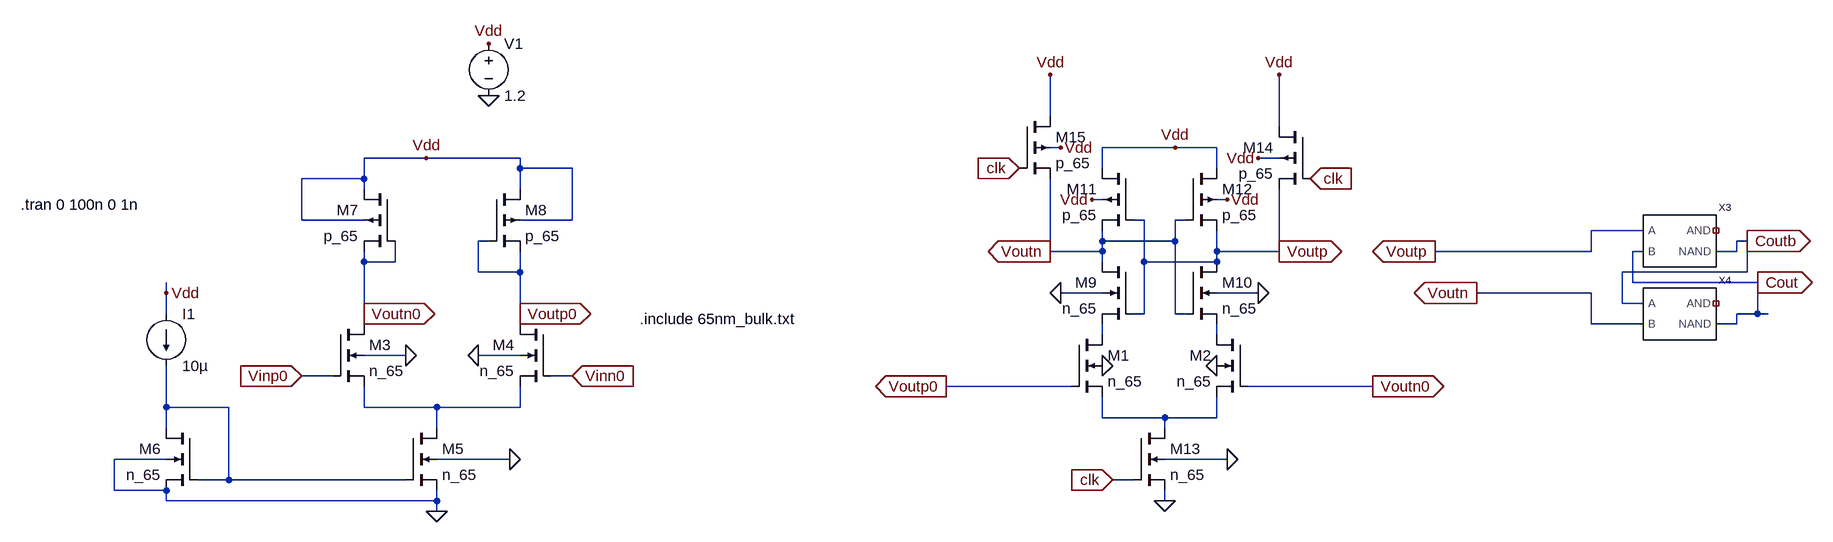
[diagram p0: schematic Comp2.asc]
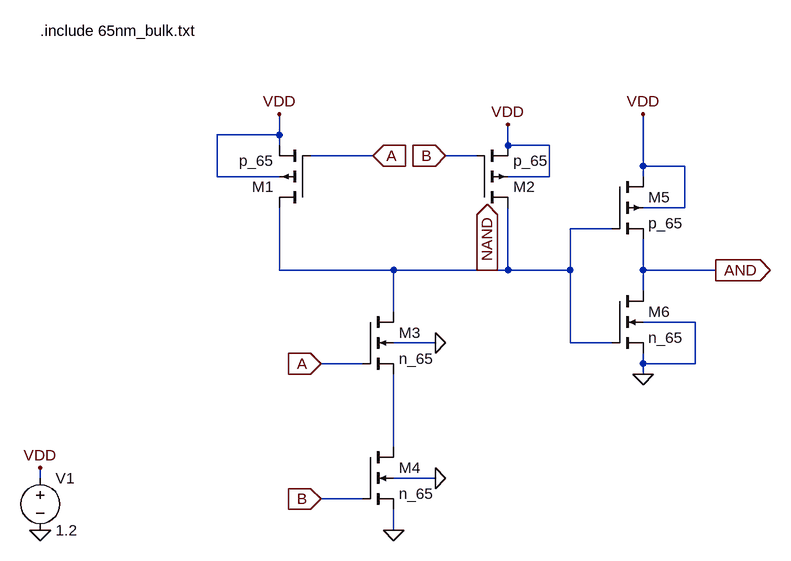
[diagram p1: sub-circuit nand.asc]
Comp2.asc, the LTspice schematic file:
Version 4
SHEET 1 2404 740
WIRE 1136 -96 1136 -160
WIRE 1488 -80 1488 -160
WIRE 1152 -48 1136 -48
WIRE 1328 -48 1216 -48
WIRE 1392 -48 1328 -48
WIRE 176 -32 80 -32
WIRE 320 -32 176 -32
WIRE 1488 -32 1456 -32
WIRE 320 -16 320 -32
WIRE 400 -16 320 -16
WIRE 1216 -16 1216 -48
WIRE 1392 -16 1392 -48
WIRE 80 0 80 -32
WIRE 80 0 -16 0
WIRE 80 16 80 0
WIRE 320 16 320 -16
WIRE 1216 32 1200 32
WIRE 1408 32 1392 32
WIRE -16 64 -16 0
WIRE 80 64 -16 64
WIRE 400 64 400 -16
WIRE 400 64 320 64
WIRE 1280 64 1264 64
WIRE 1344 64 1328 64
WIRE 2048 80 1968 80
WIRE 272 96 256 96
WIRE 1216 96 1216 80
WIRE 1328 96 1328 64
WIRE 1328 96 1216 96
WIRE 2208 96 2192 96
WIRE 1136 112 1136 0
WIRE 1216 112 1216 96
WIRE 1216 112 1136 112
WIRE 1392 112 1392 80
WIRE 1488 112 1488 16
WIRE 1488 112 1392 112
WIRE 1968 112 1968 80
WIRE 1968 112 1728 112
WIRE 2048 112 2032 112
WIRE 2192 112 2192 96
WIRE 2192 112 2160 112
WIRE 80 128 80 112
WIRE 128 128 128 96
WIRE 128 128 80 128
WIRE 1216 128 1216 112
WIRE 1280 128 1280 64
WIRE 1392 128 1392 112
WIRE 1392 128 1280 128
WIRE 256 144 256 96
WIRE 320 144 320 112
WIRE 320 144 256 144
WIRE 2208 144 2208 96
WIRE 2208 144 2016 144
WIRE 2032 160 2032 112
WIRE 2224 160 2032 160
WIRE -224 176 -224 160
WIRE 1216 176 1152 176
WIRE 1456 176 1392 176
WIRE 1968 176 1792 176
WIRE 2016 192 2016 144
WIRE 2048 192 2016 192
WIRE -224 208 -224 176
WIRE 80 208 80 128
WIRE 320 208 320 144
WIRE 1280 208 1280 128
WIRE 1280 208 1264 208
WIRE 1328 208 1328 96
WIRE 1344 208 1328 208
WIRE 2224 208 2224 160
WIRE 2224 208 2192 208
WIRE 2240 208 2224 208
WIRE 80 224 80 208
WIRE 320 224 320 208
WIRE 1968 224 1968 176
WIRE 2048 224 1968 224
WIRE 2192 224 2192 208
WIRE 2192 224 2160 224
WIRE 1216 240 1216 224
WIRE 1392 240 1392 224
WIRE 144 272 80 272
WIRE 320 272 256 272
WIRE 32 304 -16 304
WIRE 400 304 368 304
WIRE 1168 320 976 320
WIRE 1632 320 1440 320
WIRE -224 352 -224 288
WIRE -128 352 -224 352
WIRE 80 352 80 320
WIRE 192 352 80 352
WIRE 320 352 320 320
WIRE 320 352 192 352
WIRE 1216 368 1216 336
WIRE 1312 368 1216 368
WIRE 1392 368 1392 336
WIRE 1392 368 1312 368
WIRE -224 384 -224 352
WIRE 192 384 192 352
WIRE 1312 384 1312 368
WIRE -224 432 -304 432
WIRE 304 432 192 432
WIRE 1408 432 1312 432
WIRE -128 464 -128 352
WIRE -128 464 -176 464
WIRE 144 464 -128 464
WIRE 1264 464 1232 464
WIRE -304 480 -304 432
WIRE -224 480 -304 480
WIRE -224 496 -224 480
WIRE 192 496 192 480
WIRE 192 496 -224 496
WIRE 1312 496 1312 480
WIRE 192 512 192 496
FLAG 192 512 0
FLAG 272 -208 Vdd
FLAG 272 -128 0
FLAG 256 272 0
FLAG 144 272 0
FLAG -16 304 Vinp0
IOPIN -16 304 In
FLAG 400 304 Vinn0
IOPIN 400 304 In
FLAG 320 208 Voutp0
IOPIN 320 208 Out
FLAG 80 208 Voutn0
IOPIN 80 208 Out
FLAG 304 432 0
FLAG -224 176 Vdd
FLAG 176 -32 Vdd
FLAG 1136 -160 Vdd
FLAG 1488 -160 Vdd
FLAG 1312 496 0
FLAG 1232 464 clk
IOPIN 1232 464 In
FLAG 1328 -48 Vdd
FLAG 1152 176 0
FLAG 1456 176 0
FLAG 1408 432 0
FLAG 1408 32 Vdd
FLAG 1200 32 Vdd
FLAG 1456 -32 Vdd
FLAG 1152 -48 Vdd
FLAG 1088 -16 clk
IOPIN 1088 -16 In
FLAG 1536 0 clk
IOPIN 1536 0 In
FLAG 1136 112 Voutn
IOPIN 1136 112 Out
FLAG 1488 112 Voutp
IOPIN 1488 112 Out
FLAG 1216 288 0
FLAG 1392 288 0
FLAG 976 320 Voutp0
IOPIN 976 320 Out
FLAG 1632 320 Voutn0
IOPIN 1632 320 Out
FLAG 2224 160 Cout
IOPIN 2224 160 Out
FLAG 2208 96 Coutb
IOPIN 2208 96 Out
FLAG 1728 112 Voutp
IOPIN 1728 112 Out
FLAG 1792 176 Voutn
IOPIN 1792 176 Out
DATAFLAG 80 192 ""
DATAFLAG 80 464 ""
DATAFLAG 192 368 ""
SYMBOL nmos4 32 224 R0
SYMATTR InstName M3
SYMATTR Value n_65
SYMATTR Value2 l=1u w=80u
SYMBOL nmos4 368 224 M0
SYMATTR InstName M4
SYMATTR Value n_65
SYMATTR Value2 l=1u w=80u
SYMBOL nmos4 144 384 R0
SYMATTR InstName M5
SYMATTR Value n_65
SYMATTR Value2 l=1u w=160u
SYMBOL voltage 272 -224 R0
WINDOW 123 0 0 Left 0
WINDOW 39 0 0 Left 0
SYMATTR InstName V1
SYMATTR Value 1.2
SYMBOL nmos4 -176 384 M0
SYMATTR InstName M6
SYMATTR Value n_65
SYMATTR Value2 l=1u w=80u
SYMBOL current -224 208 R0
WINDOW 123 0 0 Left 0
WINDOW 39 0 0 Left 0
SYMATTR InstName I1
SYMATTR Value 10µ
SYMBOL pmos4 128 16 M0
SYMATTR InstName M7
SYMATTR Value p_65
SYMATTR Value2 l=1u w=2u
SYMBOL pmos4 272 16 R0
SYMATTR InstName M8
SYMATTR Value p_65
SYMATTR Value2 l=1u w=2u
SYMBOL nmos4 1168 240 R0
SYMATTR InstName M1
SYMATTR Value n_65
SYMATTR Value2 l=0.1u w=10u
SYMBOL nmos4 1440 240 M0
SYMATTR InstName M2
SYMATTR Value n_65
SYMATTR Value2 l=0.1u w=10u
SYMBOL nmos4 1264 128 M0
SYMATTR InstName M9
SYMATTR Value n_65
SYMATTR Value2 l=65n w=0.8u
SYMBOL nmos4 1344 128 R0
SYMATTR InstName M10
SYMATTR Value n_65
SYMATTR Value2 l=65n w=0.8u
SYMBOL pmos4 1264 -16 M0
SYMATTR InstName M11
SYMATTR Value p_65
SYMATTR Value2 l=65n w=1.6u
SYMBOL pmos4 1344 -16 R0
SYMATTR InstName M12
SYMATTR Value p_65
SYMATTR Value2 l=65n w=1.6u
SYMBOL nmos4 1264 384 R0
SYMATTR InstName M13
SYMATTR Value n_65
SYMATTR Value2 l=0.1u w=20u
SYMBOL pmos4 1536 -80 M0
SYMATTR InstName M14
SYMATTR Value p_65
SYMATTR Value2 l=65n w=1u
SYMBOL pmos4 1088 -96 R0
SYMATTR InstName M15
SYMATTR Value p_65
SYMATTR Value2 l=65n w=1u
SYMBOL nand 2096 96 R0
SYMATTR InstName X3
SYMBOL nand 2096 208 R0
SYMATTR InstName X4
TEXT 504 216 Left 2 !.include 65nm_bulk.txt
TEXT -448 40 Left 2 !.tran 0 100n 0 1n

nand.asc, the sub-circuit schematic file:
Version 4
SHEET 1 1500 944
WIRE 560 224 560 192
WIRE 560 224 464 224
WIRE 560 240 560 224
WIRE 912 240 912 208
WIRE 976 240 912 240
WIRE 704 256 608 256
WIRE 864 256 816 256
WIRE 1120 272 1120 192
WIRE 1184 272 1120 272
WIRE 464 288 464 224
WIRE 560 288 464 288
WIRE 976 288 976 240
WIRE 976 288 912 288
WIRE 1120 288 1120 272
WIRE 1184 336 1184 272
WIRE 1184 336 1120 336
WIRE 1072 368 1008 368
WIRE 560 432 560 336
WIRE 736 432 560 432
WIRE 880 432 736 432
WIRE 912 432 912 336
WIRE 912 432 880 432
WIRE 1008 432 1008 368
WIRE 1008 432 912 432
WIRE 1120 432 1120 384
WIRE 1232 432 1120 432
WIRE 1120 464 1120 432
WIRE 736 496 736 432
WIRE 1200 512 1120 512
WIRE 800 544 736 544
WIRE 1008 544 1008 432
WIRE 1072 544 1008 544
WIRE 688 576 624 576
WIRE 1120 576 1120 560
WIRE 1200 576 1200 512
WIRE 1200 576 1120 576
WIRE 1120 592 1120 576
WIRE 736 704 736 592
WIRE 192 752 192 736
WIRE 800 752 736 752
WIRE 688 784 624 784
WIRE 736 832 736 800
FLAG 1232 432 AND
IOPIN 1232 432 Out
FLAG 192 832 0
FLAG 1120 592 0
FLAG 880 432 NAND
IOPIN 880 432 Out
FLAG 704 256 A
IOPIN 704 256 In
FLAG 816 256 B
IOPIN 816 256 In
FLAG 624 576 A
IOPIN 624 576 In
FLAG 624 784 B
IOPIN 624 784 In
FLAG 800 544 0
FLAG 800 752 0
FLAG 736 832 0
FLAG 192 736 VDD
FLAG 560 192 VDD
FLAG 912 208 VDD
FLAG 1120 192 VDD
SYMBOL pmos4 608 336 R180
SYMATTR InstName M1
SYMATTR Value p_65
SYMATTR Value2 l=65n w=2u
SYMBOL pmos4 864 336 M180
SYMATTR InstName M2
SYMATTR Value p_65
SYMATTR Value2 l=65n w=2u
SYMBOL nmos4 688 496 R0
SYMATTR InstName M3
SYMATTR Value n_65
SYMATTR Value2 l=65n w=1u
SYMBOL nmos4 688 704 R0
SYMATTR InstName M4
SYMATTR Value n_65
SYMATTR Value2 l=65n w=1u
SYMBOL pmos4 1072 288 R0
SYMATTR InstName M5
SYMATTR Value2 l=65n w=4u
SYMATTR Value p_65
SYMBOL nmos4 1072 464 R0
SYMATTR InstName M6
SYMATTR Value2 l=65n w=2u
SYMATTR Value n_65
SYMBOL Voltage 192 736 R0
SYMATTR InstName V1
SYMATTR Value 1.2
TEXT 192 64 Left 2 !.include 65nm_bulk.txt

The netlist it stands for:
* Comp2.asc
M3 Voutn0 Vinp0 N004 0 n_65 l=1u w=80u
M4 Voutp0 Vinn0 N004 0 n_65 l=1u w=80u
M5 N004 N003 0 0 n_65 l=1u w=160u
V1 Vdd 0 1.2
M6 N003 N003 0 0 n_65 l=1u w=80u
I1 Vdd N003 10µ
M7 Vdd Voutn0 Voutn0 Vdd p_65 l=1u w=2u
M8 Vdd Voutp0 Voutp0 Vdd p_65 l=1u w=2u
M1 N001 Voutp0 N005 0 n_65 l=0.1u w=10u
M2 N002 Voutn0 N005 0 n_65 l=0.1u w=10u
M9 Voutn Voutp N001 0 n_65 l=65n w=0.8u
M10 Voutp Voutn N002 0 n_65 l=65n w=0.8u
M11 Vdd Voutp Voutn Vdd p_65 l=65n w=1.6u
M12 Vdd Voutn Voutp Vdd p_65 l=65n w=1.6u
M13 N005 clk 0 0 n_65 l=0.1u w=20u
M14 Vdd clk Voutp Vdd p_65 l=65n w=1u
M15 Vdd clk Voutn Vdd p_65 l=65n w=1u
XX3 Voutp Cout NC_01 Coutb nand
XX4 Coutb Voutn NC_02 Cout nand

* block symbol definitions
.subckt nand A B AND NAND
M1 NAND A VDD VDD p_65 l=65n w=2u
M2 NAND B VDD VDD p_65 l=65n w=2u
M3 NAND A N001 0 n_65 l=65n w=1u
M4 N001 B 0 0 n_65 l=65n w=1u
M5 VDD NAND AND VDD p_65 l=65n w=4u
M6 AND NAND 0 0 n_65 l=65n w=2u
V1 VDD 0 1.2
.include 65nm_bulk.txt
.ends nand

.model NMOS NMOS
.model PMOS PMOS
.lib standard.mos
.include 65nm_bulk.txt
.tran 0 100n 0 1n
.backanno
.end